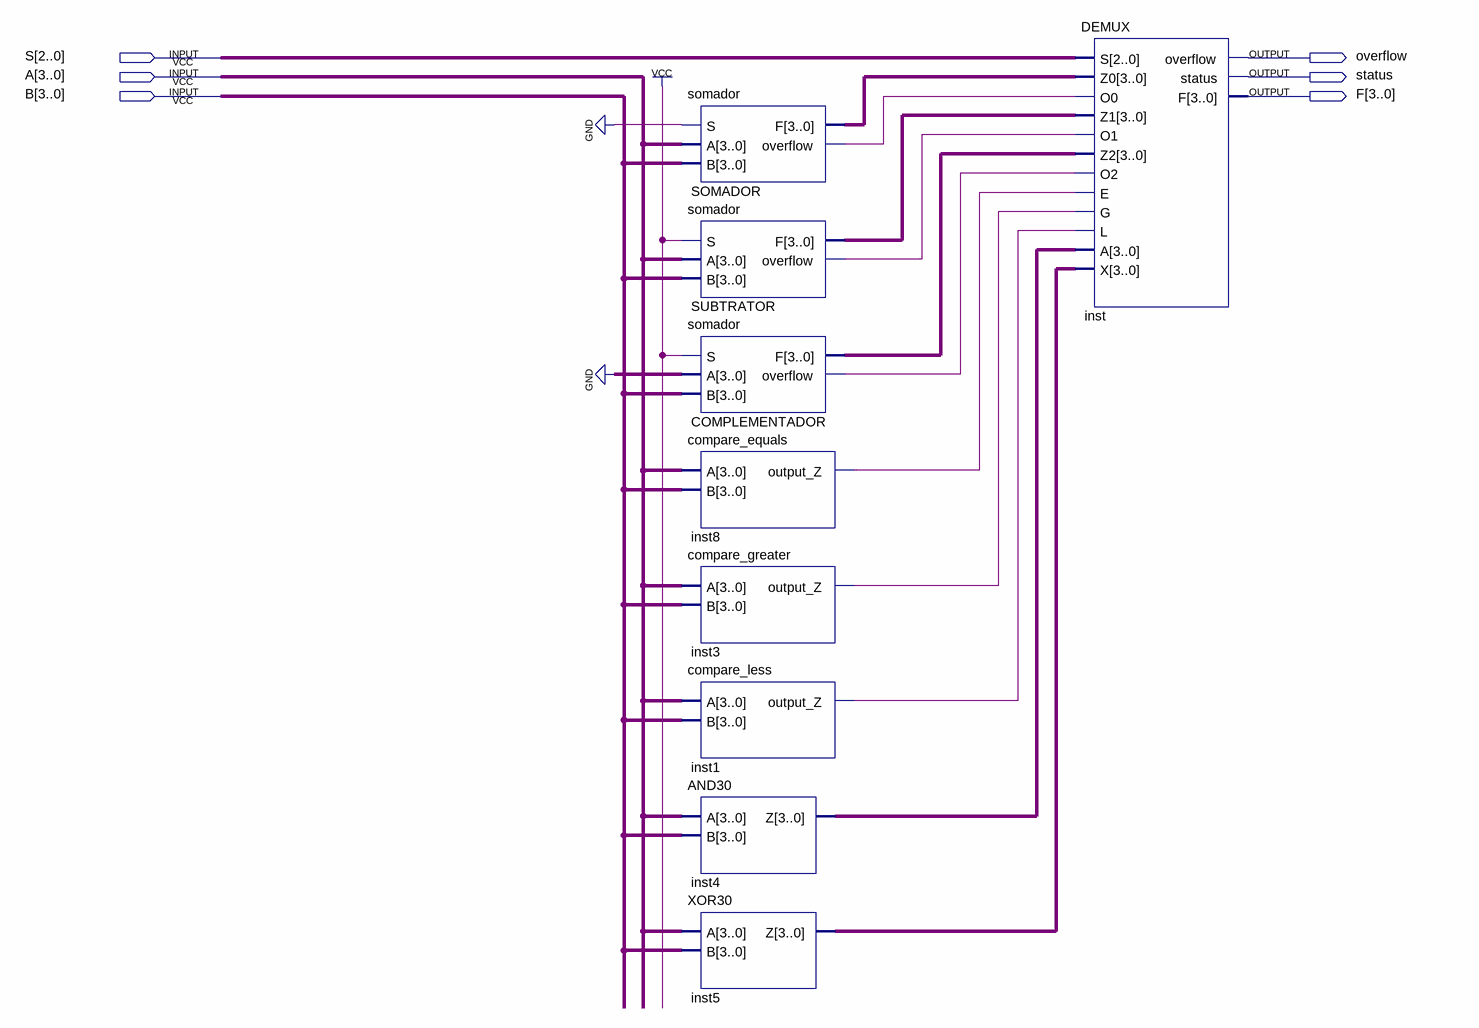
[diagram p0: schematic sheet]
// Quartus schematic ULA.bdf as structural Verilog: 9 symbols, 6 pins
module ULA (
  input  [2:0] S,
  input  [3:0] A,
  input  [3:0] B,
  output overflow,
  output status,
  output [3:0] F
);

  wire COMPLEMENTADOR_overflow, inst1_output_z, inst3_output_z, inst8_output_z, SOMADOR_overflow,
       SUBTRATOR_overflow;
  wire [3:0] COMPLEMENTADOR_f, inst4_z, inst5_z, SOMADOR_f, SUBTRATOR_f;

  somador SOMADOR (.S(1'b0), .A(A), .B(B), .F(SOMADOR_f), .overflow(SOMADOR_overflow));
  somador SUBTRATOR (.S(1'b1), .A(A), .B(B), .F(SUBTRATOR_f), .overflow(SUBTRATOR_overflow));
  somador COMPLEMENTADOR (.S(1'b1), .A(4'b0000), .B(B), .F(COMPLEMENTADOR_f), .overflow(COMPLEMENTADOR_overflow));
  compare_equals inst8 (.A(A), .B(B), .output_Z(inst8_output_z));
  compare_greater inst3 (.A(A), .B(B), .output_Z(inst3_output_z));
  compare_less inst1 (.A(A), .B(B), .output_Z(inst1_output_z));
  AND30 inst4 (.A(A), .B(B), .Z(inst4_z));
  XOR30 inst5 (.A(A), .B(B), .Z(inst5_z));
  DEMUX inst (
    .S(S), .Z0(SOMADOR_f), .O0(SOMADOR_overflow), .Z1(SUBTRATOR_f), .O1(SUBTRATOR_overflow),
    .Z2(COMPLEMENTADOR_f), .O2(COMPLEMENTADOR_overflow), .E(inst8_output_z), .G(inst3_output_z),
    .L(inst1_output_z), .A(inst4_z), .X(inst5_z), .overflow(overflow), .status(status), .F(F));
endmodule
